# EAGLE design Meganrev_1 (EAGLE 9.5.2)
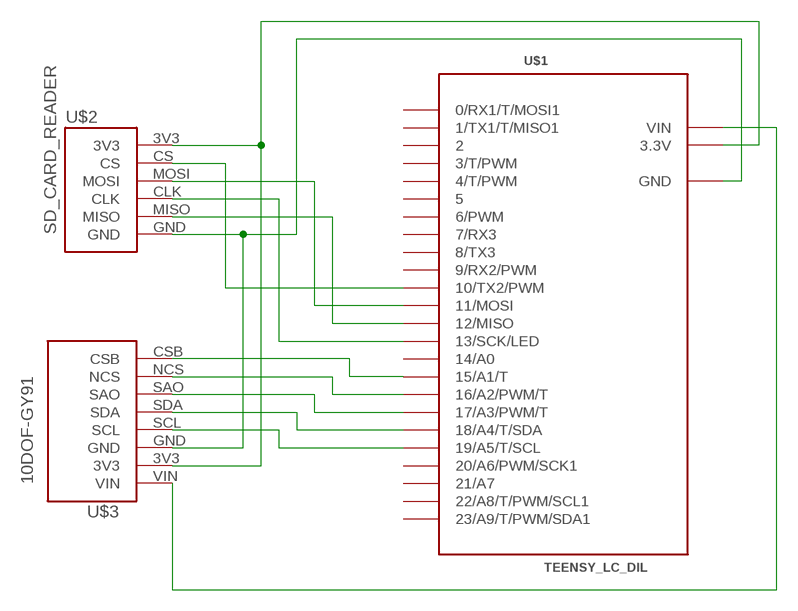
[diagram p0: schematic, sheet 1]

## Parts
U$1  TEENSY_LC_DIL  [TEENSY_3.0-3.2&LC_DIL]
U$2  SD_CARD_READER  [MICRO_SD_READER_3V3]
U$3  10DOF-GY91  [10DOF-GY-91]

## Nets
N$1: U$1.19/A5(19/A5/T/SCL) U$3.SCL
N$2: U$1.AGND(GND) U$1.GND U$2.GND U$3.GND
N$3: U$1.12(12/MISO) U$2.MISO
N$4: U$1.11(11/MOSI) U$2.MOSI
N$5: U$1.13(13/SCK/LED) U$2.CLK
N$6: U$1.VIN U$3.VIN
N$8: U$1.18/A4(18/A4/T/SDA) U$3.SDA
N$9: U$1.17/A3(17/A3/PWM/T) U$3.SAO
N$10: U$1.16/A2(16/A2/PWM/T) U$3.NCS
N$11: U$1.10(10/TX2/PWM) U$2.CS
N$12: U$1.15/A1(15/A1/T) U$3.CSB
N$13: U$1.3.3V U$2.3V3 U$3.3V3
Unconnected: U$1.0(0/RX1/T/MOSI1) U$1.1(1/TX1/T/MISO1) U$1.2 U$1.3(3/T/PWM) U$1.4(4/T/PWM) U$1.5 U$1.6(6/PWM) U$1.7(7/RX3) U$1.8(8/TX3) U$1.9(9/RX2/PWM) U$1.14/A0 U$1.20/A6(20/A6/PWM/SCK1) U$1.21/A7 U$1.22/A8(22/A8/T/PWM/SCL1) U$1.23/A9(23/A9/T/PWM/SDA1)

## Library data of the parts
U$1 = Teensy_3_and_LC_Series_Boards_v1.4:TEENSY_LC_DIL
U$2 = macrocketry_2019:SD_CARD_READER
U$3 = macrocketry_2019:10DOF-GY91

## Board
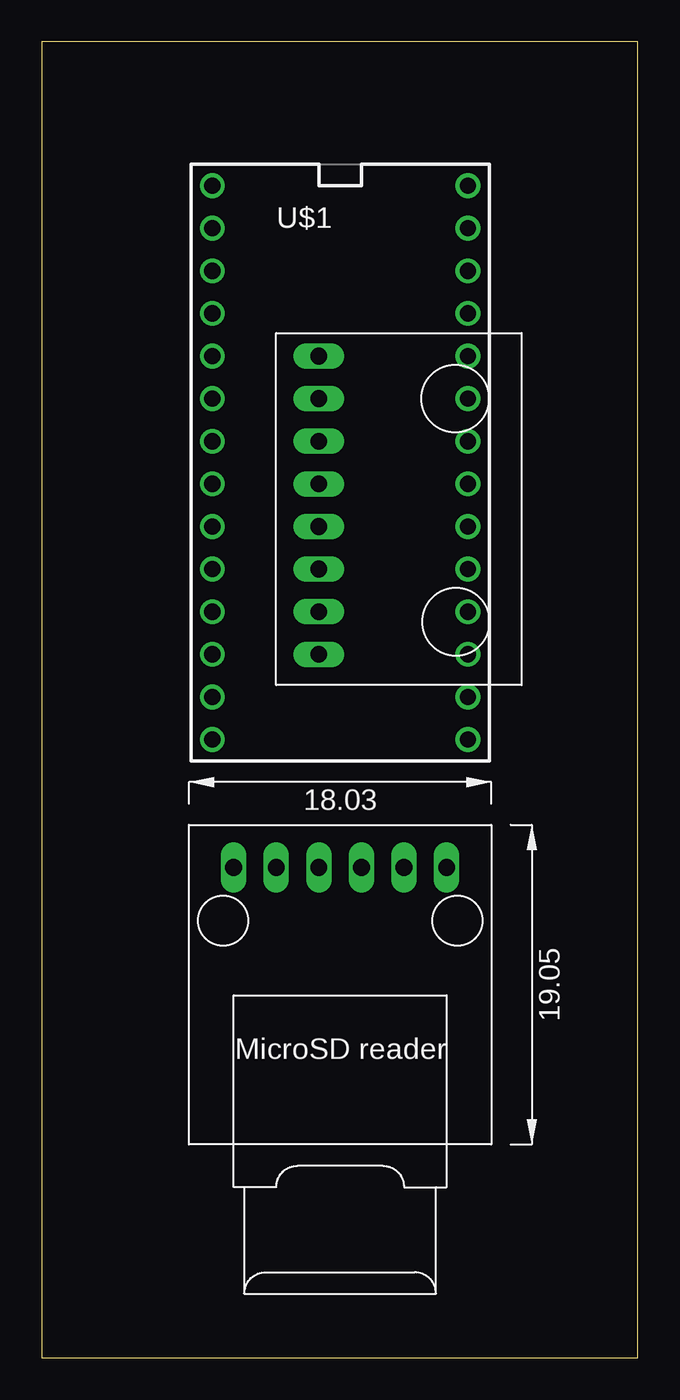
[diagram p1: board, top side]
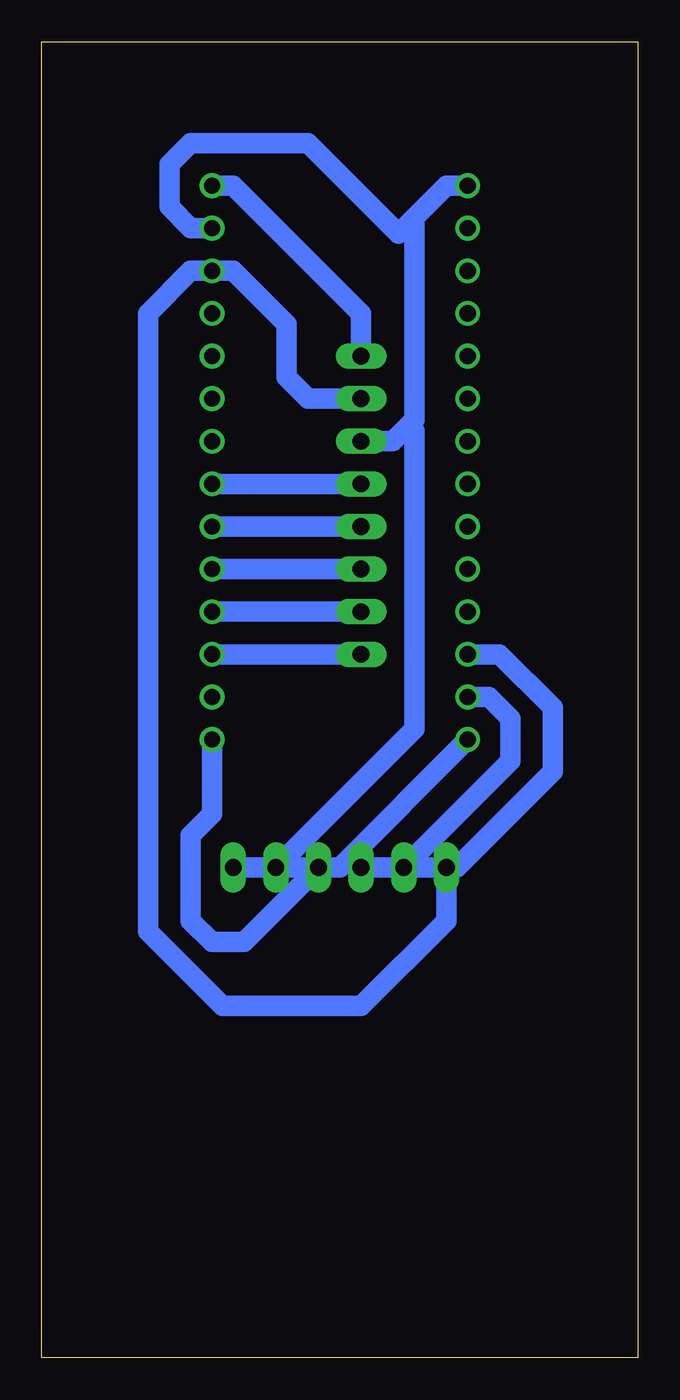
[diagram p2: board, bottom side, seen from below]

Size 35.54 x 78.41 mm. Coordinates in mm from the lower left corner, seen from the top.
Outline: 0,0 35.54,0 35.54,78.41 0,78.41 0,0
Copper layers (1*16): Top 0.035mm / dielectric 1.5mm / Bottom 0.035mm
Design rules "default *": minimum track width 48mil, minimum drill 0.35mm, track to track 36mil, track to pad 36mil, pad to pad 6mil, via to via 6mil, smd to smd 6mil, copper to edge 36mil, drill to drill 6mil, minimum pad ring 10mil, minimum via ring 8mil, stop-mask expansion 4mil, vias tented up to drill 0mil, thermal gap 10mil

### Footprints (pad centres in the part's own frame; a part is rotated, then mirrored left to right if it is on the bottom)
TEENSY_3.0-3.2&LC_DIL = drill 0.965: 0 -7.62,13.97; 1 -7.62,11.43; 2 -7.62,8.89; 3 -7.62,6.35; 3.3V 7.62,11.43; 4 -7.62,3.81; 5 -7.62,1.27; 6 -7.62,-1.27; 7 -7.62,-3.81; 8 -7.62,-6.35; 9 -7.62,-8.89; 10 -7.62,-11.43; 11 -7.62,-13.97; 12 -7.62,-16.51; 13 7.62,-16.51; 14/A0 7.62,-13.97; 15/A1 7.62,-11.43; 16/A2 7.62,-8.89; 17/A3 7.62,-6.35; 18/A4 7.62,-3.81; 19/A5 7.62,-1.27; 20/A6 7.62,1.27; 21/A7 7.62,3.81; 22/A8 7.62,6.35; 23/A9 7.62,8.89; AGND 7.62,13.97; GND -7.62,16.51; VIN 7.62,16.51
MICRO_SD_READER_3V3 = drill 1 long: 3V3 5.08,6.35; CLK 5.08,-1.27; CS 5.08,3.81; GND 5.08,-6.35; MISO 5.08,-3.81; MOSI 5.08,1.27
10DOF-GY-91 = drill 1 pad 1.422 long: 3V3 -3.81,5.08; CSB -3.81,-10.16; GND -3.81,2.54; NCS -3.81,-7.62; SAO -3.81,-5.08; SCL -3.81,0; SDA -3.81,-2.54; VIN -3.81,7.62

### Placement (x,y rotation side)
U$1  17.78,53.34 0 top
U$2  17.78,24.13 90 top
U$3  20.32,52.07 0 top

### Tracks (layer width: path | path; a pad name or v marks a point on that pad's centre or on a via)
N$1
  Bottom 1.219: U$3.SCL U$1.19/A5
N$2
  Bottom 1.219: U$1.GND 11.43,69.85 13.34,67.94 | 13.34,67.94 14.29,66.99 19.68,72.39 26.67,72.39 27.94,71.12 27.94,68.58 26.67,67.31 U$1.AGND | 13.34,67.94 13.34,55.88 13.65,55.56 | 13.65,55.56 14.61,54.61 U$3.GND | U$2.GND 21.59,29.21 13.34,37.47 13.34,55.24 13.65,55.56
N$3
  Bottom 1.219: U$2.MISO 17.78,29.21 U$1.12
N$4
  Bottom 1.219: U$1.11 8.89,39.37 7.62,38.1 7.62,35.56 13.97,29.21 U$2.MOSI
N$5
  Bottom 1.219: U$1.13 25.4,32.38 26.67,31.11 26.67,26.04 25.4,24.77 23.5,24.77 U$2.CLK
N$6
  Bottom 1.219: U$1.VIN 24.13,69.85 16.51,62.23 U$3.VIN
N$8
  Bottom 1.219: U$3.SDA U$1.18/A4
N$9
  Bottom 1.219: U$3.SAO U$1.17/A3
N$10
  Bottom 1.219: U$3.NCS U$1.16/A2
N$11
  Bottom 1.219: U$1.10 8.26,41.91 5.08,38.73 5.08,34.92 10.79,29.21 U$2.CS
N$12
  Bottom 1.219: U$3.CSB U$1.15/A1
N$13
  Bottom 1.219: U$3.3V3 19.68,57.15 20.95,58.42 20.95,61.59 24.13,64.77 U$1.3.3V 26.67,64.77 29.21,62.23 29.21,25.4 24.77,20.95 16.51,20.95 11.43,26.04 U$2.3V3